# EAGLE design electricity-meter-wifi (EAGLE 7.6.0)
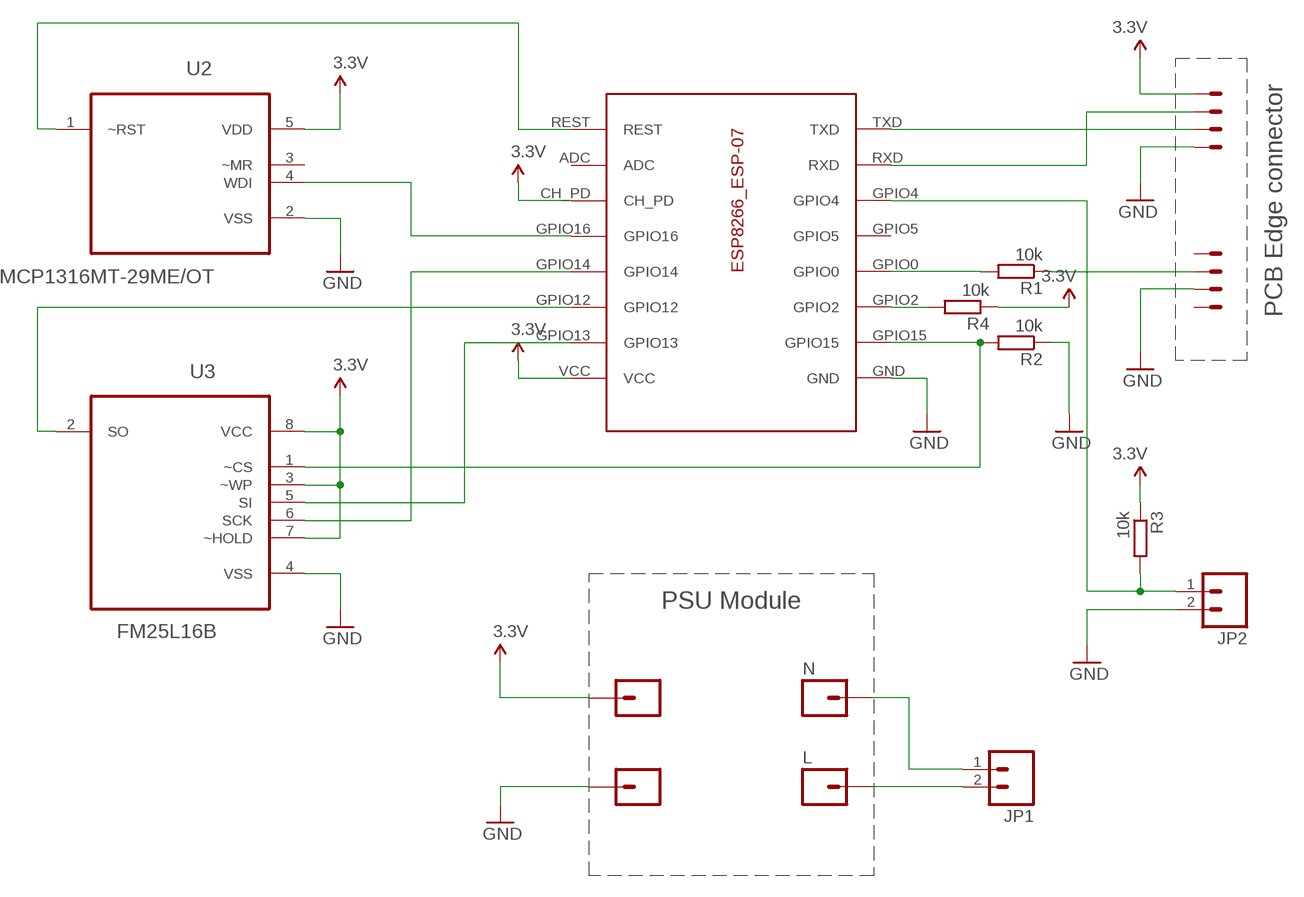
[diagram p0: schematic, sheet 1]

## Parts
3.3V  M01PTH_2MM  [1X01_2MM]
ESP8266_ESP-07  ESP8266-07  [ESP-07]
GND  M01PTH_2MM  [1X01_2MM]
JP1  M02PTH3_5MM  [1X02_LONGPADS]
JP2  M02PTH3_5MM  [1X02_LONGPADS]
L  M01PTH_2MM  [1X01_2MM]
N  M01PTH_2MM  [1X01_2MM]
R1  10k  R-EU_R0805  [R0805]
R2  10k  R-EU_R0805  [R0805]
R3  10k  R-EU_R0805  [R0805]
R4  10k  R-EU_R0805  [R0805]
U2  MCP1316MT-29ME/OT  MCP1316T-29LE/OT  [SOT95P270X145-5N]
U3  FM25L16B  25AA020A-I/SN  [SOIC127P600X175-8N]
U$1  CON-PCB-SLOT-0.05MINIMAL  [CONN_SLOT_MINIMAL]

## Nets
3.3V: 3.3V.1 ESP8266_ESP-07.CH_PD ESP8266_ESP-07.VCC R3.1 R4.1 U2.5(VDD) U3.3(~WP) U3.7(~HOLD) U3.8(VCC) U$1.4
GND: ESP8266_ESP-07.GND GND.1 JP2.2 R2.1 U2.2(VSS) U3.4(VSS) U$1.1 U$1.7
N$1: ESP8266_ESP-07.TXD U$1.2
N$2: ESP8266_ESP-07.RXD U$1.3
N$3: ESP8266_ESP-07.GPIO4 JP2.1 R3.2
N$4: ESP8266_ESP-07.GPIO0 R1.2
N$5: JP1.2 L.1
N$6: JP1.1 N.1
N$7: ESP8266_ESP-07.GPIO15 R2.2 U3.1(~CS)
N$8: ESP8266_ESP-07.REST U2.1(~RST)
N$9: ESP8266_ESP-07.GPIO16 U2.4(WDI)
N$10: ESP8266_ESP-07.GPIO12 U3.2(SO)
N$11: R1.1 U$1.6
N$12: ESP8266_ESP-07.GPIO13 U3.5(SI)
N$13: ESP8266_ESP-07.GPIO14 U3.6(SCK)
N$14: ESP8266_ESP-07.GPIO2 R4.2
Unconnected: ESP8266_ESP-07.ADC ESP8266_ESP-07.GPIO5 U2.3(~MR) U$1.5 U$1.8

## Notes on the sheet
- PCB Edge connector
- PSU Module

## Library data of the parts
3.3V GND L N = SparkFun-Connectors:M01: Header 1 Standard 1-pin 0.1" header. Use with straight break away headers (SKU : PRT-00116), right angle break away headers (PRT-00553), swiss pins (PRT-00743), machine pins (PRT-00117), and female headers (PRT-00115).
ESP8266_ESP-07 = lio:ESP8266
JP1 JP2 = SparkFun (old):M02: Header 2 Standard 2-pin 5 mm header
R1-R4 = rcl:R-EU_: RESISTOR, European symbol
U2 = Microchip_By_element14_Batch_1:MCP1316T-29LE/OT: Voltage Supervisor; MPN: MCP1316T-29LE/OT; OC_FARNELL: 1332071; OC_NEWARK: 34M7402; PACKAGE: SOT-5; SUPPLIER: Microchip
U3 = Microchip_By_element14_Batch_1:25AA020A-I/SN: 2K SPI Bus Serial EEPROM; MPN: 25AA020A-I/SN; OC_FARNELL: 1331343; OC_NEWARK: 72J3627; PACKAGE: SOIC-8; SUPPLIER: MICROCHIP
U$1 = con-pcb-slot:CON-PCB-SLOT-0.05: PCB slot (edge) connector with 0.05" pitch (based on conventional PCI)

## Board
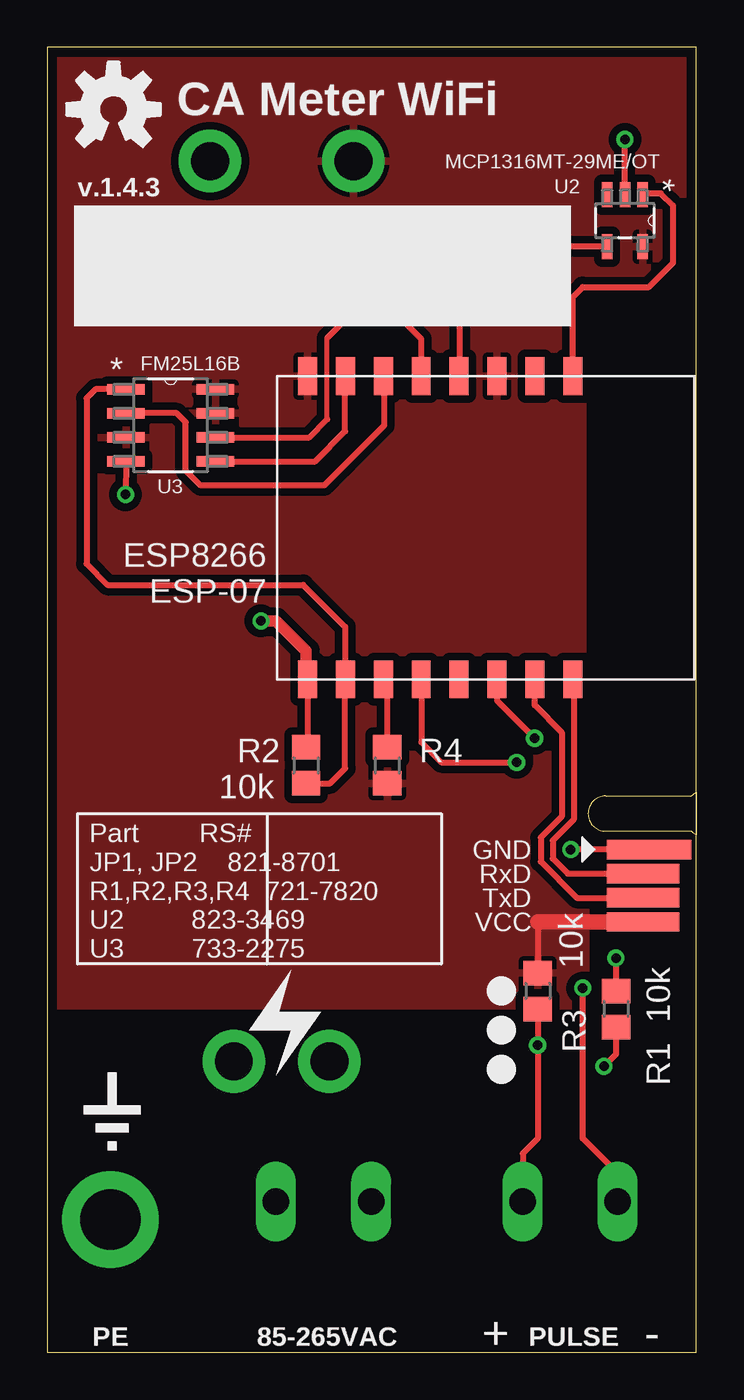
[diagram p1: board, top side]
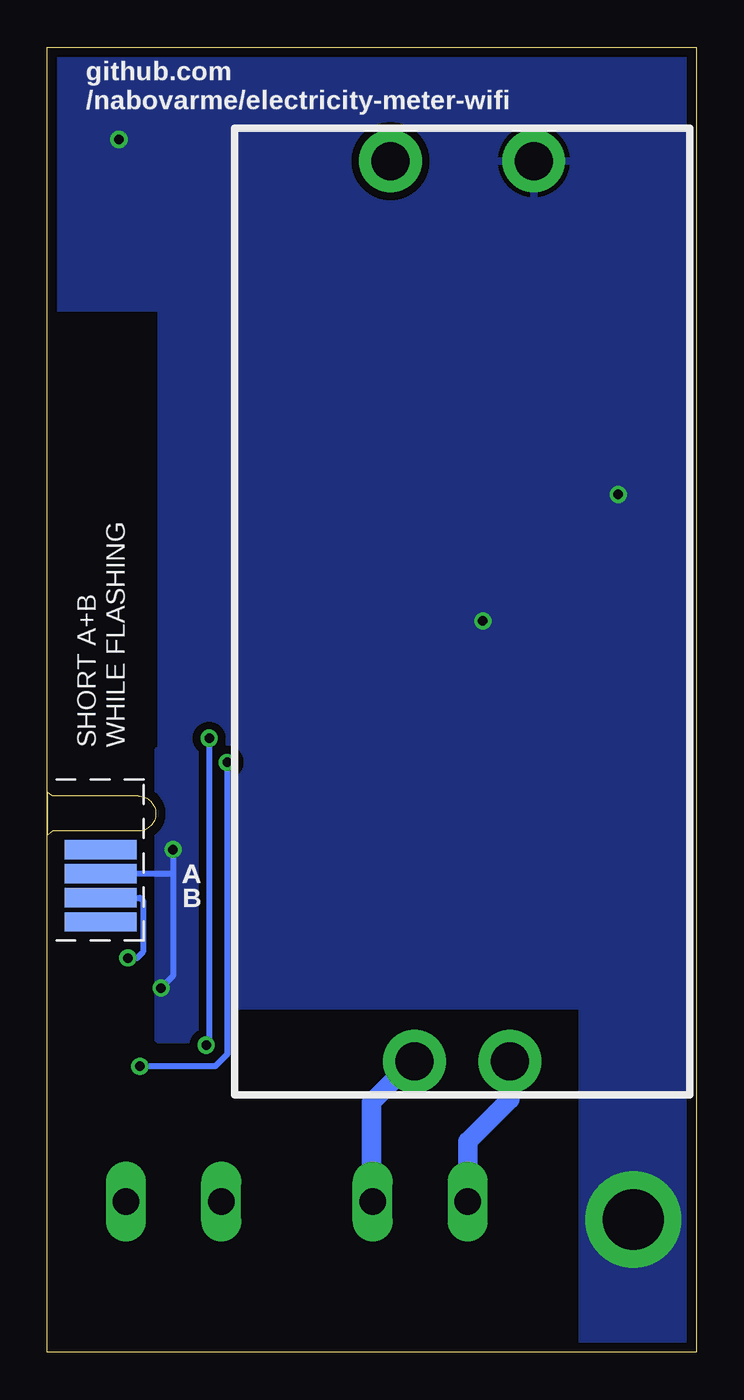
[diagram p2: board, bottom side, seen from below]

Size 34.25 x 68.83 mm. Coordinates in mm from the lower left corner, seen from the top.
Outline: 0,0 34.25,0 34.25,68.83 0,68.83 0,0
Copper layers (1*16): Top 0.035mm / dielectric 1.5mm / Bottom 0.035mm
Design rules "default *": minimum track width 10mil, minimum drill 24mil, track to track 8mil, track to pad 8mil, pad to pad 8mil, via to via 8mil, smd to smd 8mil, copper to edge 20mil, drill to drill 20mil, minimum pad ring 10mil, minimum via ring 8mil, stop-mask expansion 4mil, vias tented up to drill 0mil, thermal gap 10mil

### Footprints (pad centres in the part's own frame; a part is rotated, then mirrored left to right if it is on the bottom)
1X01_2MM = drill 2 pad 3.302: 1 0,0
ESP-07 = smd 1 x 2: ADC -1.6,-8; CH_PD 0.4,-8; GND 10.4,8; GPIO0 4.4,8; GPIO2 6.4,8; GPIO4 0.4,8; GPIO5 2.4,8; GPIO12 6.4,-8; GPIO13 8.4,-8; GPIO14 4.4,-8; GPIO15 8.4,8; GPIO16 2.4,-8; REST -3.6,-8; RXD -1.6,8; TXD -3.6,8; VCC 10.4,-8
1X02_LONGPADS = drill 1.4 pad 1.93 long: 1 0,0; 2 5.02,0
R0805 = smd 1.3 x 1.5: 1 -0.95,0; 2 0.95,0
SOT95P270X145-5N = smd 1.321 x 0.559: 1 -1.372,0.94; 2 -1.372,0; 3 -1.372,-0.94; 4 1.372,-0.94; 5 1.372,0.94
SOIC127P600X175-8N = smd 1.981 x 0.559: 1 -2.362,1.905; 2 -2.362,0.635; 3 -2.362,-0.635; 4 -2.362,-1.905; 5 2.362,-1.905; 6 2.362,-0.635; 7 2.362,0.635; 8 2.362,1.905
CONN_SLOT_MINIMAL = smd 1.016 x 4.445: 1 1.905,-0.043 | smd 1.016 x 3.81: 2 0.635,0.275; 3 -0.635,0.275; 4 -1.905,0.275 | smd 1.016 x 3.81 bottom: 5 -1.905,0.275; 6 -0.635,0.275; 7 0.635,0.275; 8 1.905,0.275

### Placement (x,y rotation side)
3.3V  16.15,62.84 0 bottom
ESP8266_ESP-07  24.13,43.5 180 top
GND  8.58,62.84 0 bottom
JP1  12.06,7.94 0 top
JP2  25.08,7.94 0 top
L  14.88,15.34 0 bottom
N  9.84,15.34 0 bottom
R1  30,18.1 270 top
R2  13.65,30.96 270 top
R3  25.88,19.05 270 top
R4  17.94,30.96 90 top
U2  30.48,59.69 270 top
U3  6.51,48.9 0 top
U$1  31.71,24.61 90 top
U$2  [OSHW-LOGO-M]  3.49,65.56 0 top

### Tracks (layer width: path | path; a pad name or v marks a point on that pad's centre or on a via)
3.3V
  Top 0.305: 25.88,22.7 R3.1
  Top 0.813: 25.88,22.7 U$1.4
  pour Top (isolate 0.406): 0.16,18.26 28.42,18.26 28.42,31.75 28.26,31.75 28.26,55.09 33.97,55.09 33.97,68.58 0.16,68.58
GND  (via drill 0.5, 3.2 pad 5.08)
  Top 0.305: U$1.1 v27.62,26.51 | v28.26,19.21 28.26,11.27 30.16,9.37 30.16,8 JP2.2 | U2.2 v30.48,63.98 | U3.4 v4.13,45.24 | ESP8266_ESP-07.GND 13.73,31.98 R2.1
  Top 0.61: 13.65,35.58 13.65,36.99 12.06,38.58 v11.27,38.58
  Top 0.813: 13.65,35.58 ESP8266_ESP-07.GND
  Bottom 0.305: U$1.7 27.62,25.24 | v27.62,26.51 27.62,19.84 v28.26,19.21
  other vias: 3.33,6.99
  pour Bottom (isolate 0.406): 0.16,0.32 6.03,0.32 6.03,18.26 24.45,18.26 24.45,16.51 28.42,16.51 28.42,31.75 28.26,31.75 28.26,55.09 33.97,55.09 33.97,68.58 0.16,68.58
N$1
  Top 0.305: ESP8266_ESP-07.TXD 27.78,35.45 27.78,28.1 26.67,26.99 26.67,26.04 27.46,25.24 U$1.2
N$2
  Top 0.305: ESP8266_ESP-07.RXD 25.72,35.48 25.72,34.13 27.15,32.7 27.15,28.26 26.04,27.15 26.04,25.88 27.94,23.97 U$1.3
N$3  (via drill 0.5)
  Top 0.305: ESP8266_ESP-07.GPIO4 23.73,34.37 v25.72,32.38 | R3.2 v25.88,16.19 25.88,11.27 25.08,10.48 JP2.1
  Bottom 0.305: v25.72,32.38 25.72,16.35 v25.88,16.19
N$4  (via drill 0.5)
  Top 0.305: 19.68,35.45 ESP8266_ESP-07.GPIO0 19.73,32.18 20.8,31.11 v24.77,31.11 | R1.2 30,15.72 v29.37,15.08
  Bottom 0.305: v24.77,31.11 24.77,15.72 25.4,15.08 v29.37,15.08
N$5
  Bottom 1.016: L.1 14.98,15.34 17.14,13.18 17.14,8 JP1.2
N$6
  Bottom 1.016: N.1 9.84,13.34 12.06,11.11 JP1.1
N$7
  Top 0.305: 15.55,35.32 ESP8266_ESP-07.GPIO15 | U3.1 2.54,50.8 2.06,50.32 2.06,41.59 3.17,40.48 13.49,40.48 15.72,38.26 15.72,35.51 ESP8266_ESP-07.GPIO15 | R2.2 14.93,30.01 15.72,30.8 15.72,35.48 ESP8266_ESP-07.GPIO15
N$8
  Top 0.305: ESP8266_ESP-07.REST 27.73,55.67 28.26,56.2 31.75,56.2 33.02,57.47 33.02,60.48 32.38,61.12 31.48,61.12 U2.1
N$9
  Top 0.305: U2.4 23.08,58.32 21.75,56.99 21.75,51.52 ESP8266_ESP-07.GPIO16
N$10
  Top 0.305: U3.2 6.83,49.53 7.3,49.05 7.3,46.51 8.1,45.72 14.61,45.72 17.78,48.9 17.78,51.45 ESP8266_ESP-07.GPIO12
N$11  (via drill 0.5)
  Top 0.305: v30,20.8 R1.1
  Bottom 0.305: U$1.6 29.37,23.97 29.21,23.81 29.21,21.11 29.53,20.8 v30,20.8
N$12
  Top 0.305: U3.5 14.13,46.99 15.72,48.58 15.72,51.48 ESP8266_ESP-07.GPIO13
N$13
  Top 0.254: 14.76,49.21 14.76,53.5
  Top 0.305: ESP8266_ESP-07.GPIO14 19.73,53.45 18.73,54.45 15.72,54.45 14.76,53.5 | U3.6 13.81,48.26 14.76,49.21
N$14
  Top 0.305: R4.2 17.94,35.29 ESP8266_ESP-07.GPIO2

### Text on the board
tNames: CA Meter WiFi | v.1.4.3 | ESP8266 / ESP-07 | GND | RxD | TxD | VCC | Part RS# / JP1, JP2 821-8701 / R1,R2,R3,R4 721-7820 / U2 823-3469 / U3 733-2275 | PE | 85-265VAC | + | PULSE | -
bNames: github.com / /nabovarme/electricity-meter-wifi | SHORT A+B / WHILE FLASHING | A | A | B